# Altium project 2019_FDP_strateasy.PrjPcb
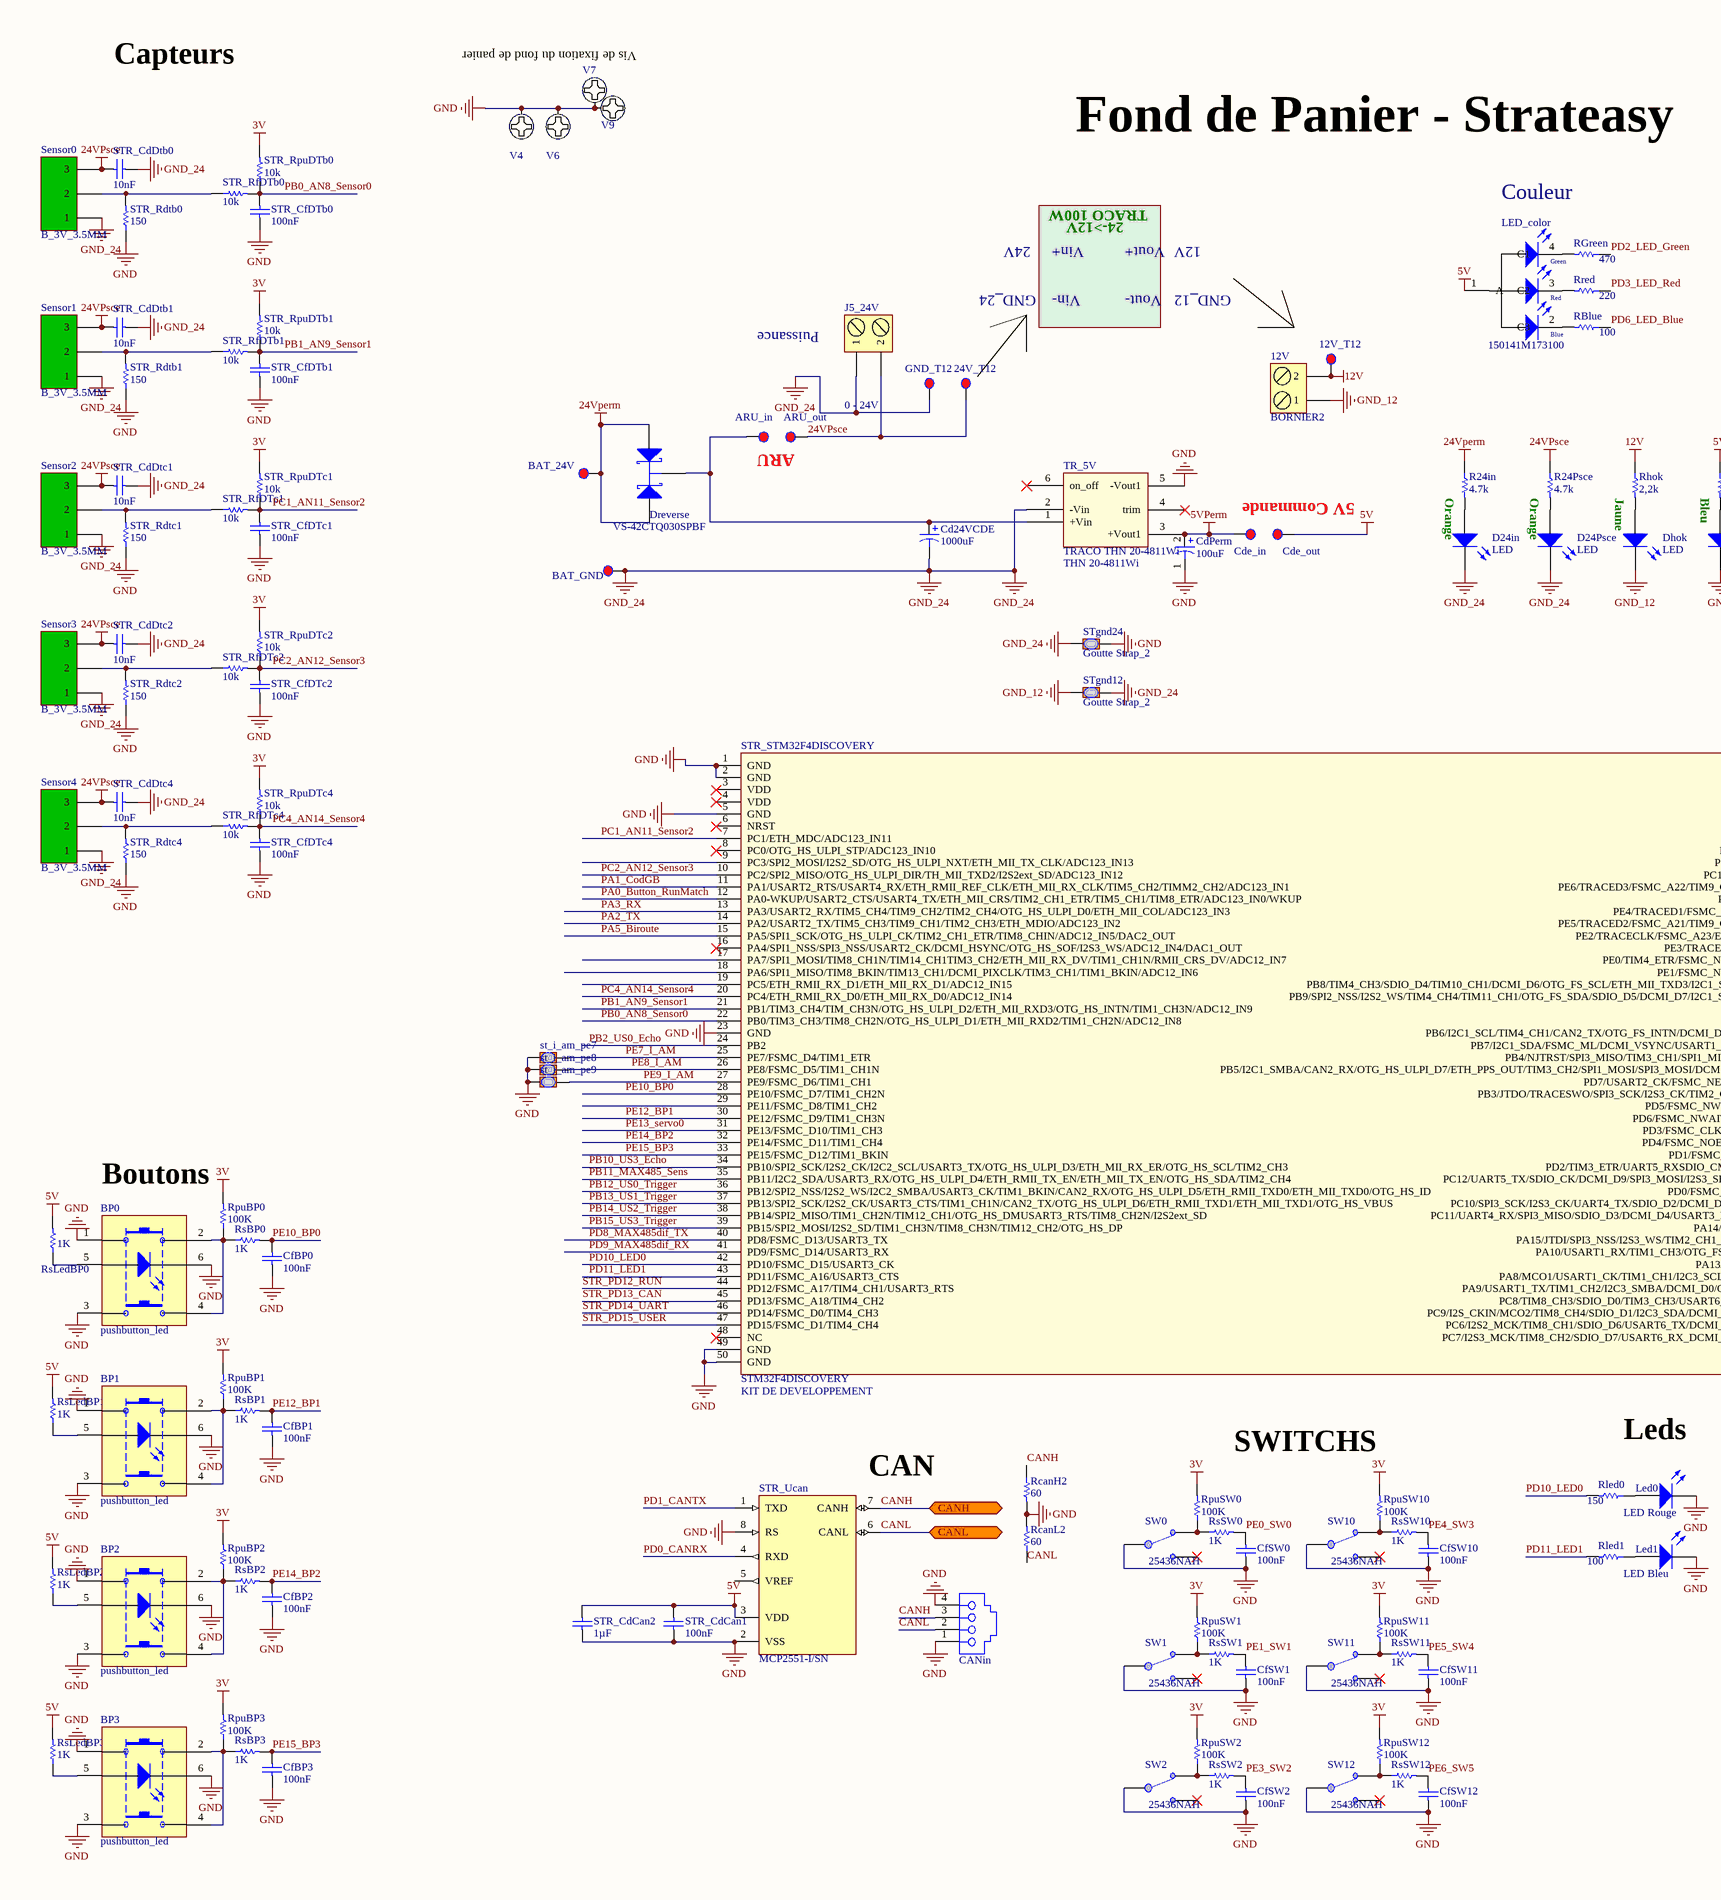
[diagram p0: 2019_FDP_SCHEMA.SchDoc, left]
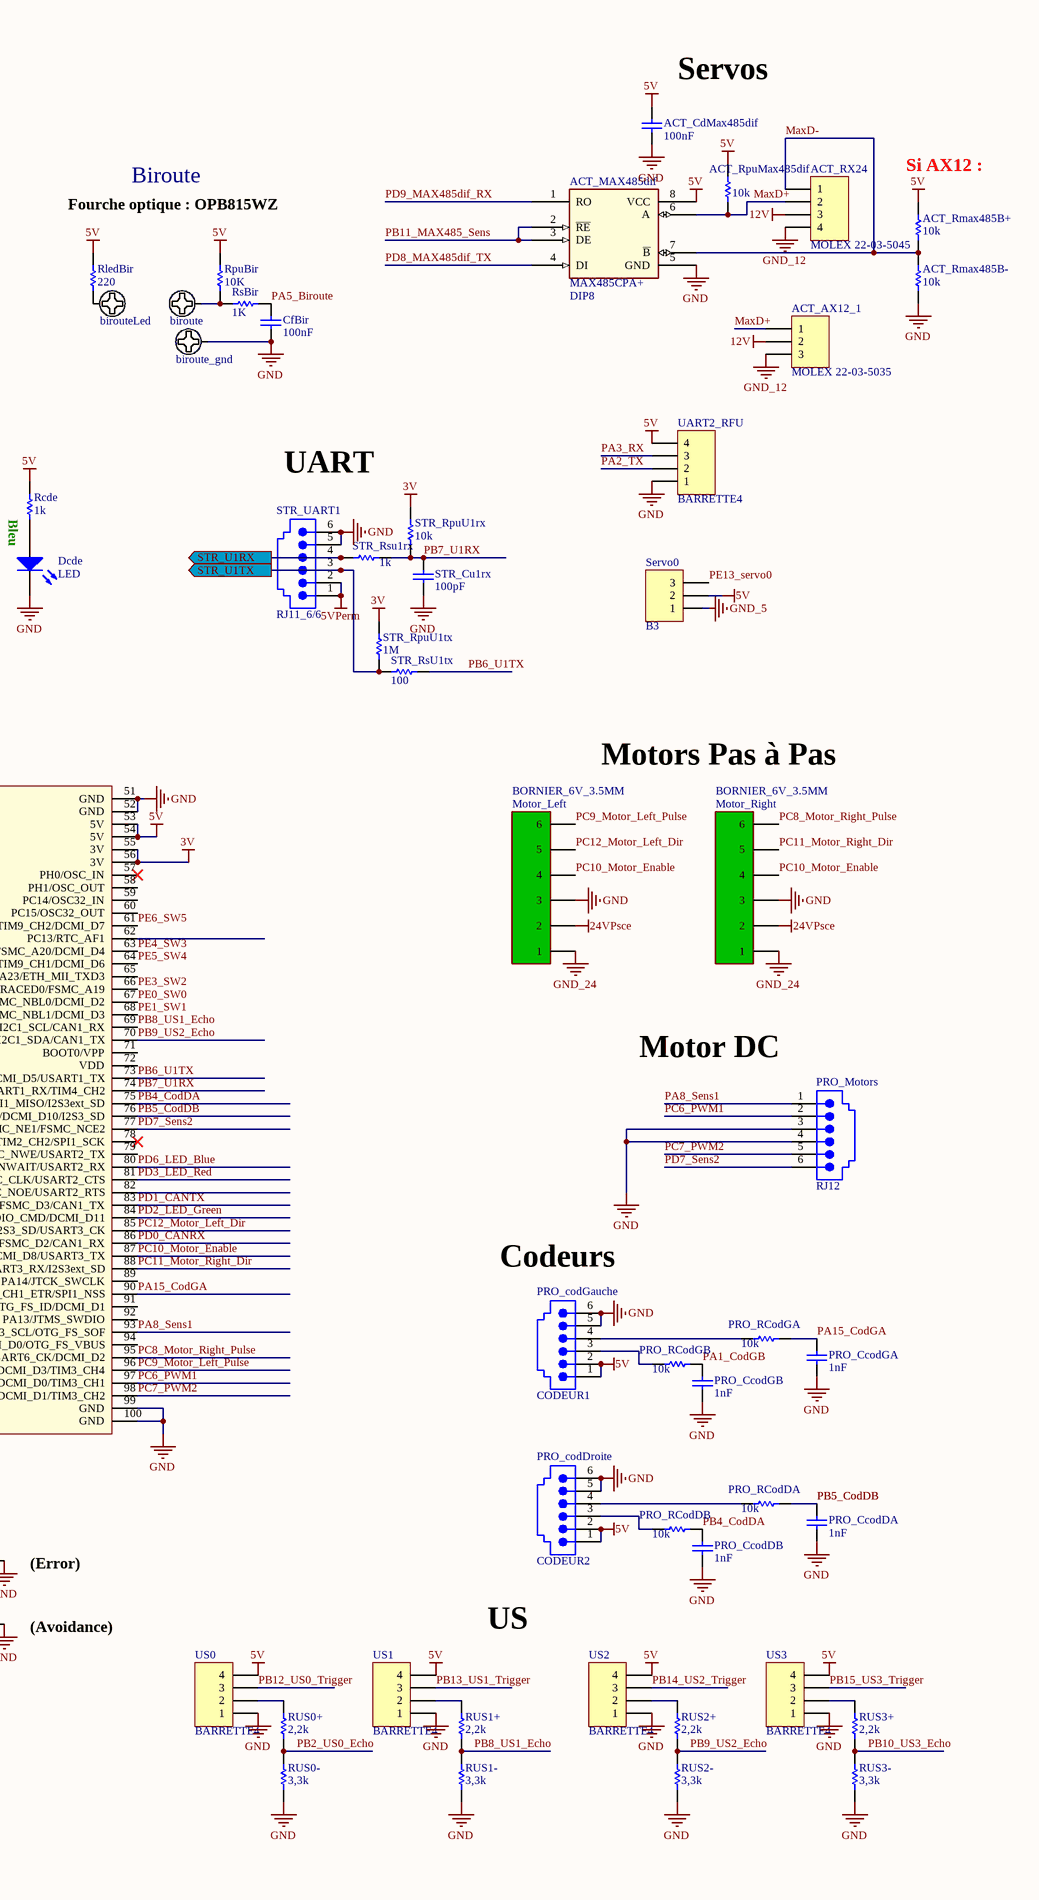
[diagram p1: 2019_FDP_SCHEMA.SchDoc, right]
1 sheet, 168 parts. Net scope: flat (ports and power ports of the same name join across sheets).
Board file: 2019_FDP_strateasy.PcbDoc

## Sheet 2019_FDP_SCHEMA.SchDoc
size A2

### Parts
12V  BORNIER2  [BORNIER_2V_5.08MM]
12V_T12  Name  [Point Test_D3_P1.6mm]  (value not drawn)
24V_T12  Name  [Point Test_D3_P1.6mm]  (value not drawn)
ACT_AX12_1  MOLEX 22-03-5035  [MOLEX3_2.5MM]
ACT_CdMax485dif  100nF  [C0805_N]
ACT_MAX485dif  Type: MAX485CPA+  Package: DIP8  [SO8_N]  (hidden comment: MAX485CPA+_DIP8)
ACT_Rmax485B+  10k  [R1206_N]
ACT_Rmax485B-  10k  [R1206_N]
ACT_RpuMax485dif  10k  [R1206_N]
ACT_RX24  MOLEX 22-03-5045  [MOLEX4_2.5MM]
ARU_in  Name  [Point Test_D3_P1.6mm]  (value not drawn)
ARU_out  Name  [Point Test_D3_P1.6mm]  (value not drawn)
BAT_24V  Name  [Point Test_D3_P1.6mm]  (value not drawn)
BAT_GND  Name  [Point Test_D3_P1.6mm]  (value not drawn)
biroute  Pad_M3  [PAD_CMS_5.08x2.54]  (value not drawn)
biroute_gnd  Pad_M3  [PAD_CMS_5.08x2.54]  (value not drawn)
birouteLed  Pad_M3  [PAD_CMS_5.08x2.54]  (value not drawn)
BP0  pushbutton_led  [PUSHBUTTON_LED]
BP1  pushbutton_led  [PUSHBUTTON_LED]
BP2  pushbutton_led  [PUSHBUTTON_LED]
BP3  pushbutton_led  [PUSHBUTTON_LED]
CANin  634104149621  [634104149621]  (value not drawn)
Cd24VCDE  1000uF  [RESISTANCE_5W]
Cde_in  Name  [Point Test_D3_P1.6mm]  (value not drawn)
Cde_out  Name  [Point Test_D3_P1.6mm]  (value not drawn)
CdPerm  100uF  [CONDENSATEUR_POLARISE_ELECTROLYTIQUE_RADIAL_5.08/8.9]
CfBir  100nF  [C0805_N]
CfBP0  100nF  [C0805_N]
CfBP1  100nF  [C0805_N]
CfBP2  100nF  [C0805_N]
CfBP3  100nF  [C0805_N]
CfSW0  100nF  [C0805_N]
CfSW1  100nF  [C0805_N]
CfSW2  100nF  [C0805_N]
CfSW10  100nF  [C0805_N]
CfSW11  100nF  [C0805_N]
CfSW12  100nF  [C0805_N]
D24in  LED  [LED_0805]
D24Psce  LED  [LED_0805]
Dcde  LED  [LED_0805]
Dhok  LED  [LED_0805]
Dreverse  VS-42CTQ030SPBF  [D2Pak (123)]
GND_T12  Name  [Point Test_D3_P1.6mm]  (value not drawn)
J5_24V  0 - 24V  [BORNIER2_FEM_COUDE]
Led0  LED Rouge  [LED_0805]
Led1  LED Bleu  [LED_0805]
LED_color  150141M173100  [3528]
Motor_Left  BORNIER_6V_3.5MM  [BORNIER_6V_3.5MM]
Motor_Right  BORNIER_6V_3.5MM  [BORNIER_6V_3.5MM]
PRO_CcodDA  1nF  [C0805_N]
PRO_CcodDB  1nF  [C0805_N]
PRO_CcodGA  1nF  [C0805_N]
PRO_CcodGB  1nF  [C0805_N]
PRO_codDroite  CODEUR2  [RJ11_6/6 - droit]
PRO_codGauche  CODEUR1  [RJ11_6/6 - droit]
PRO_Motors  RJ12  [RJ11_6/6 - droit]
PRO_RCodDA  10k  [R1206_N]
PRO_RCodDB  10k  [R1206_N]
PRO_RCodGA  10k  [R1206_N]
PRO_RCodGB  10k  [R1206_N]
R24in  4.7k  [R1206_N]
R24Psce  4.7k  [R1206_N]
RBlue  100  [R1206_N]
RcanH2  60  [R1206_N]
RcanL2  60  [R1206_N]
Rcde  1k  [R1206_N]
RGreen  470  [R1206_N]
Rhok  2,2k  [R1206_N]
Rled0  150  [R1206_N]
Rled1  100  [R1206_N]
RledBir  220  [R1206_N]
RpuBir  10K  [R1206_N]
RpuBP0  100K  [R1206_N]
RpuBP1  100K  [R1206_N]
RpuBP2  100K  [R1206_N]
RpuBP3  100K  [R1206_N]
RpuSW0  100K  [R1206_N]
RpuSW1  100K  [R1206_N]
RpuSW2  100K  [R1206_N]
RpuSW10  100K  [R1206_N]
RpuSW11  100K  [R1206_N]
RpuSW12  100K  [R1206_N]
Rred  220  [R1206_N]
RsBir  1K  [R1206_N]
RsBP0  1K  [R1206_N]
RsBP1  1K  [R1206_N]
RsBP2  1K  [R1206_N]
RsBP3  1K  [R1206_N]
RsLedBP0  1K  [R1206_N]
RsLedBP1  1K  [R1206_N]
RsLedBP2  1K  [R1206_N]
RsLedBP3  1K  [R1206_N]
RsSW0  1K  [R1206_N]
RsSW1  1K  [R1206_N]
RsSW2  1K  [R1206_N]
RsSW10  1K  [R1206_N]
RsSW11  1K  [R1206_N]
RsSW12  1K  [R1206_N]
RUS0+  2,2k  [R1206_N]
RUS0-  3,3k  [R1206_N]
RUS1+  2,2k  [R1206_N]
RUS1-  3,3k  [R1206_N]
RUS2+  2,2k  [R1206_N]
RUS2-  3,3k  [R1206_N]
RUS3+  2,2k  [R1206_N]
RUS3-  3,3k  [R1206_N]
Sensor0  B_3V_3.5MM  [BORNIER_3V_3.5MM]
Sensor1  B_3V_3.5MM  [BORNIER_3V_3.5MM]
Sensor2  B_3V_3.5MM  [BORNIER_3V_3.5MM]
Sensor3  B_3V_3.5MM  [BORNIER_3V_3.5MM]
Sensor4  B_3V_3.5MM  [BORNIER_3V_3.5MM]
Servo0  B3  [HE14_3]
st_i_am_pe7  Goutte Strap_2  [Goutte Strap_2 Pads_Clearance 0.254mm]  (value not drawn)
st_i_am_pe8  Goutte Strap_2  [Goutte Strap_2 Pads_Clearance 0.254mm]  (value not drawn)
st_i_am_pe9  Goutte Strap_2  [Goutte Strap_2 Pads_Clearance 0.254mm]  (value not drawn)
STgnd12  Goutte Strap_2  [Goutte Strap_2 Pads_Clearance 0.254mm]
STgnd24  Goutte Strap_2  [Goutte Strap_2 Pads_Clearance 0.254mm]
STR_CdCan1  100nF  [C0805_N]
STR_CdCan2  1µF  [C0805_N]
STR_CdDtb0  10nF  [C0805_N]
STR_CdDtb1  10nF  [C0805_N]
STR_CdDtc1  10nF  [C0805_N]
STR_CdDtc2  10nF  [C0805_N]
STR_CdDtc4  10nF  [C0805_N]
STR_CfDTb0  100nF  [C0805_N]
STR_CfDTb1  100nF  [C0805_N]
STR_CfDTc1  100nF  [C0805_N]
STR_CfDTc2  100nF  [C0805_N]
STR_CfDTc4  100nF  [C0805_N]
STR_Cu1rx  100pF  [C0805_N]
STR_Rdtb0  150  [R1206_N]
STR_Rdtb1  150  [R1206_N]
STR_Rdtc1  150  [R1206_N]
STR_Rdtc2  150  [R1206_N]
STR_Rdtc4  150  [R1206_N]
STR_RfDTb0  10k  [R1206_N]
STR_RfDTb1  10k  [R1206_N]
STR_RfDTc1  10k  [R1206_N]
STR_RfDTc2  10k  [R1206_N]
STR_RfDTc4  10k  [R1206_N]
STR_RpuDTb0  10k  [R1206_N]
STR_RpuDTb1  10k  [R1206_N]
STR_RpuDTc1  10k  [R1206_N]
STR_RpuDTc2  10k  [R1206_N]
STR_RpuDTc4  10k  [R1206_N]
STR_RpuU1rx  10k  [R1206_N]
STR_RpuU1tx  1M  [R1206_N]
STR_Rsu1rx  1k  [R1206_N]
STR_RsU1tx  100  [R1206_N]
STR_STM32F4DISCOVERY  STM32F4DISCOVERY  Type: KIT DE DEVELOPPEMENT  [STM32_F4DISCOVERY]
STR_UART1  RJ11_6/6  [RJ11_6/6 - droit]
STR_Ucan  MCP2551-I/SN  [SO8_N]
SW0  25436NAH  [SW_UNIPOL_DROIT - Ebay - SPDT - 11x6x5]
SW1  25436NAH  [SW_UNIPOL_DROIT - Ebay - SPDT - 11x6x5]
SW2  25436NAH  [SW_UNIPOL_DROIT - Ebay - SPDT - 11x6x5]
SW10  25436NAH  [SW_UNIPOL_DROIT - Ebay - SPDT - 11x6x5]
SW11  25436NAH  [SW_UNIPOL_DROIT - Ebay - SPDT - 11x6x5]
SW12  25436NAH  [SW_UNIPOL_DROIT - Ebay - SPDT - 11x6x5]
TR_5V  TRACO THN 20-4811Wi  Ref: THN 20-4811Wi  [TRACO_THN20]
UART2_RFU  BARRETTE4  [HE14_4]
US0  BARRETTE4  [HE14_4]
US1  BARRETTE4  [HE14_4]
US2  BARRETTE4  [HE14_4]
US3  BARRETTE4  [HE14_4]
V4  Pad_M3  [M3x6mm Torx]  (value not drawn)
V6  Pad_M3  [M3x6mm Torx]  (value not drawn)
V7  Pad_M3  [M3x6mm Torx]  (value not drawn)
V9  Pad_M3  [M3x6mm Torx]  (value not drawn)

### Ports
CANH (bidir), CANL (bidir), STR_U1RX (out), STR_U1TX (out)

### Nets
3V: RpuBP0.2 RpuBP1.2 RpuBP2.2 RpuBP3.2 RpuSW0.2 RpuSW1.2 RpuSW2.2 RpuSW10.2 RpuSW11.2 RpuSW12.2 STR_RpuDTb0.2 STR_RpuDTb1.2 STR_RpuDTc1.2 STR_RpuDTc2.2 STR_RpuDTc4.2 STR_RpuU1rx.2 STR_RpuU1tx.2 STR_STM32F4DISCOVERY.55(3V) STR_STM32F4DISCOVERY.56(3V)
5V: ACT_CdMax485dif.2 ACT_MAX485dif.8(VCC) ACT_Rmax485B+.2 ACT_RpuMax485dif.2 Cde_out.1 LED_color.1(A) PRO_codDroite.1 PRO_codDroite.2 PRO_codGauche.1 PRO_codGauche.2 Rcde.1 RledBir.2 RpuBir.2 RsLedBP0.2 RsLedBP1.2 RsLedBP2.2 RsLedBP3.2 Servo0.2 STR_CdCan1.2 STR_CdCan2.2 STR_STM32F4DISCOVERY.53(5V) STR_STM32F4DISCOVERY.54(5V) STR_Ucan.3(VDD) UART2_RFU.4 US0.4 US1.4 US2.4 US3.4
5VPerm: Cde_in.1 CdPerm.2 STR_UART1.1 STR_UART1.2 TR_5V.3(+Vout1)
12V: 12V.2 12V_T12.1 ACT_AX12_1.2 ACT_RX24.3 Rhok.1
24Vperm: BAT_24V.1 Dreverse.1(A1) Dreverse.3(A2) R24in.1
24VPsce: 24V_T12.1 ARU_out.1 J5_24V.2 Motor_Left.2 Motor_Right.2 R24Psce.1 Sensor0.3 Sensor1.3 Sensor2.3 Sensor3.3 Sensor4.3 STR_CdDtb0.2 STR_CdDtb1.2 STR_CdDtc1.2 STR_CdDtc2.2 STR_CdDtc4.2
GND: ACT_CdMax485dif.1 ACT_MAX485dif.5(GND) ACT_Rmax485B-.1 biroute_gnd.1 BP0.1 BP0.3 BP0.6(-) BP1.1 BP1.3 BP1.6(-) BP2.1 BP2.3 BP2.6(-) BP3.1 BP3.3 BP3.6(-) CANin.1 CANin.4 CdPerm.1 CfBir.1 CfBP0.1 CfBP1.1 CfBP2.1 CfBP3.1 CfSW0.1 CfSW1.1 CfSW2.1 CfSW10.1 CfSW11.1 CfSW12.1 Dcde.2(K) Led0.2(K) Led1.2(K) Motor_Left.3 Motor_Right.3 PRO_CcodDA.1 PRO_CcodDB.1 PRO_CcodGA.1 PRO_CcodGB.1 PRO_codDroite.5 PRO_codDroite.6 PRO_codGauche.5 PRO_codGauche.6 PRO_Motors.3 PRO_Motors.4 RcanH2.2 RcanL2.2 RUS0-.1 RUS1-.1 RUS2-.1 RUS3-.1 st_i_am_pe7.1 st_i_am_pe8.1 st_i_am_pe9.1 STgnd24.2 STR_CdCan1.1 STR_CdCan2.1 STR_CfDTb0.1 STR_CfDTb1.1 STR_CfDTc1.1 STR_CfDTc2.1 STR_CfDTc4.1 STR_Cu1rx.1 STR_Rdtb0.1 STR_Rdtb1.1 STR_Rdtc1.1 STR_Rdtc2.1 STR_Rdtc4.1 STR_STM32F4DISCOVERY.1(GND) STR_STM32F4DISCOVERY.2(GND) STR_STM32F4DISCOVERY.5(GND) STR_STM32F4DISCOVERY.23(GND) STR_STM32F4DISCOVERY.49(GND) STR_STM32F4DISCOVERY.50(GND) STR_STM32F4DISCOVERY.51(GND) STR_STM32F4DISCOVERY.52(GND) STR_STM32F4DISCOVERY.99(GND) STR_STM32F4DISCOVERY.100(GND) STR_UART1.5 STR_UART1.6 STR_Ucan.2(VSS) STR_Ucan.8(RS) SW0.COMMON1 SW1.COMMON1 SW2.COMMON1 SW10.COMMON1 SW11.COMMON1 SW12.COMMON1 TR_5V.5(-Vout1) UART2_RFU.1 US0.1 US1.1 US2.1 US3.1 V4.1 V6.1 V7.1 V9.1
GND_5: Servo0.1
GND_12: 12V.1 ACT_AX12_1.3 ACT_RX24.4 Dhok.2(K) STgnd12.1
GND_24: BAT_GND.1 Cd24VCDE.1 D24in.2(K) D24Psce.2(K) GND_T12.1 J5_24V.1 Motor_Left.1 Motor_Right.1 Sensor0.1 Sensor1.1 Sensor2.1 Sensor3.1 Sensor4.1 STgnd12.2 STgnd24.1 STR_CdDtb0.1 STR_CdDtb1.1 STR_CdDtc1.1 STR_CdDtc2.1 STR_CdDtc4.1 TR_5V.2(-Vin)
CANH: CANin.3 RcanH2.1 STR_Ucan.7(CANH) ; port CANH
CANL: CANin.2 RcanL2.1 STR_Ucan.6(CANL) ; port CANL
MaxD+: ACT_AX12_1.1 ACT_MAX485dif.6(A) ACT_RpuMax485dif.1 ACT_RX24.2
MaxD-: ACT_MAX485dif.7(~{B}) ACT_Rmax485B+.1 ACT_Rmax485B-.2 ACT_RX24.1
PA0_Button_RunMatch: STR_STM32F4DISCOVERY.12(PA0-WKUP/USART2_CTS/USART4_TX/ETH_MII_CRS/TIM2_CH1_ETR/TIM5_CH1/TIM8_ETR/ADC123_IN0/WKUP)
PA1_CodGB: PRO_CcodGB.2 PRO_RCodGB.1 STR_STM32F4DISCOVERY.11(PA1/USART2_RTS/USART4_RX/ETH_RMII_REF_CLK/ETH_MII_RX_CLK/TIM5_CH2/TIMM2_CH2/ADC123_IN1)
PA2_TX: STR_STM32F4DISCOVERY.14(PA2/USART2_TX/TIM5_CH3/TIM9_CH1/TIM2_CH3/ETH_MDIO/ADC123_IN2) UART2_RFU.2
PA3_RX: STR_STM32F4DISCOVERY.13(PA3/USART2_RX/TIM5_CH4/TIM9_CH2/TIM2_CH4/OTG_HS_ULPI_D0/ETH_MII_COL/ADC123_IN3) UART2_RFU.3
PA5_Biroute: CfBir.2 RsBir.2 STR_STM32F4DISCOVERY.15(PA5/SPI1_SCK/OTG_HS_ULPI_CK/TIM2_CH1_ETR/TIM8_CHIN/ADC12_IN5/DAC2_OUT)
PA8_Sens1: PRO_Motors.1 STR_STM32F4DISCOVERY.93(PA8/MCO1/USART1_CK/TIM1_CH1/I2C3_SCL/OTG_FS_SOF)
PA15_CodGA: PRO_CcodGA.2 PRO_RCodGA.1 STR_STM32F4DISCOVERY.90(PA15/JTDI/SPI3_NSS/I2S3_WS/TIM2_CH1_ETR/SPI1_NSS)
PB0_AN8_Sensor0: STR_CfDTb0.2 STR_RfDTb0.2 STR_RpuDTb0.1 STR_STM32F4DISCOVERY.22(PB0/TIM3_CH3/TIM8_CH2N/OTG_HS_ULPI_D1/ETH_MII_RXD2/TIM1_CH2N/ADC12_IN8)
PB1_AN9_Sensor1: STR_CfDTb1.2 STR_RfDTb1.2 STR_RpuDTb1.1 STR_STM32F4DISCOVERY.21(PB1/TIM3_CH4/TIM_CH3N/OTG_HS_ULPI_D2/ETH_MII_RXD3/OTG_HS_INTN/TIM1_CH3N/ADC12_IN9)
PB2_US0_Echo: RUS0+.1 RUS0-.2 STR_STM32F4DISCOVERY.24(PB2)
PB4_CodDA: PRO_CcodDB.2 PRO_RCodDB.1 STR_STM32F4DISCOVERY.75(PB4/NJTRST/SPI3_MISO/TIM3_CH1/SPI1_MISO/I2S3ext_SD)
PB5_CodDB: PRO_CcodDA.2 PRO_RCodDA.1 STR_STM32F4DISCOVERY.76(PB5/I2C1_SMBA/CAN2_RX/OTG_HS_ULPI_D7/ETH_PPS_OUT/TIM3_CH2/SPI1_MOSI/SPI3_MOSI/DCMI_D10/I2S3_SD)
PB6_U1TX: STR_RsU1tx.2 STR_STM32F4DISCOVERY.73(PB6/I2C1_SCL/TIM4_CH1/CAN2_TX/OTG_FS_INTN/DCMI_D5/USART1_TX)
PB7_U1RX: STR_Cu1rx.2 STR_RpuU1rx.1 STR_Rsu1rx.1 STR_STM32F4DISCOVERY.74(PB7/I2C1_SDA/FSMC_ML/DCMI_VSYNC/USART1_RX/TIM4_CH2)
PB8_US1_Echo: RUS1+.1 RUS1-.2 STR_STM32F4DISCOVERY.69(PB8/TIM4_CH3/SDIO_D4/TIM10_CH1/DCMI_D6/OTG_FS_SCL/ETH_MII_TXD3/I2C1_SCL/CAN1_RX)
PB9_US2_Echo: RUS2+.1 RUS2-.2 STR_STM32F4DISCOVERY.70(PB9/SPI2_NSS/I2S2_WS/TIM4_CH4/TIM11_CH1/OTG_FS_SDA/SDIO_D5/DCMI_D7/I2C1_SDA/CAN1_TX)
PB10_US3_Echo: RUS3+.1 RUS3-.2 STR_STM32F4DISCOVERY.34(PB10/SPI2_SCK/I2S2_CK/I2C2_SCL/USART3_TX/OTG_HS_ULPI_D3/ETH_MII_RX_ER/OTG_HS_SCL/TIM2_CH3)
PB11_MAX485_Sens: ACT_MAX485dif.2(~{RE}) ACT_MAX485dif.3(DE) STR_STM32F4DISCOVERY.35(PB11/I2C2_SDA/USART3_RX/OTG_HS_ULPI_D4/ETH_RMII_TX_EN/ETH_MII_TX_EN/OTG_HS_SDA/TIM2_CH4)
PB12_US0_Trigger: STR_STM32F4DISCOVERY.36(PB12/SPI2_NSS/I2S2_WS/I2C2_SMBA/USART3_CK/TIM1_BKIN/CAN2_RX/OTG_HS_ULPI_D5/ETH_RMII_TXD0/ETH_MII_TXD0/OTG_HS_ID) US0.3
PB13_US1_Trigger: STR_STM32F4DISCOVERY.37(PB13/SPI2_SCK/I2S2_CK/USART3_CTS/TIM1_CH1N/CAN2_TX/OTG_HS_ULPI_D6/ETH_RMII_TXD1/ETH_MII_TXD1/OTG_HS_VBUS) US1.3
PB14_US2_Trigger: STR_STM32F4DISCOVERY.38(PB14/SPI2_MISO/TIM1_CH2N/TIM12_CH1/OTG_HS_DMUSART3_RTS/TIM8_CH2N/I2S2ext_SD) US2.3
PB15_US3_Trigger: STR_STM32F4DISCOVERY.39(PB15/SPI2_MOSI/I2S2_SD/TIM1_CH3N/TIM8_CH3N/TIM12_CH2/OTG_HS_DP) US3.3
PC1_AN11_Sensor2: STR_CfDTc1.2 STR_RfDTc1.2 STR_RpuDTc1.1 STR_STM32F4DISCOVERY.7(PC1/ETH_MDC/ADC123_IN11)
PC2_AN12_Sensor3: STR_CfDTc2.2 STR_RfDTc2.2 STR_RpuDTc2.1 STR_STM32F4DISCOVERY.10(PC2/SPI2_MISO/OTG_HS_ULPI_DIR/TH_MII_TXD2/I2S2ext_SD/ADC123_IN12)
PC4_AN14_Sensor4: STR_CfDTc4.2 STR_RfDTc4.2 STR_RpuDTc4.1 STR_STM32F4DISCOVERY.20(PC4/ETH_RMII_RX_D0/ETH_MII_RX_D0/ADC12_IN14)
PC6_PWM1: PRO_Motors.2 STR_STM32F4DISCOVERY.97(PC6/I2S2_MCK/TIM8_CH1/SDIO_D6/USART6_TX/DCMI_D0/TIM3_CH1)
PC7_PWM2: PRO_Motors.5 STR_STM32F4DISCOVERY.98(PC7/I2S3_MCK/TIM8_CH2/SDIO_D7/USART6_RX_DCMI_D1/TIM3_CH2)
PC8_Motor_Right_Pulse: Motor_Right.6 STR_STM32F4DISCOVERY.95(PC8/TIM8_CH3/SDIO_D0/TIM3_CH3/USART6_CK/DCMI_D2)
PC9_Motor_Left_Pulse: Motor_Left.6 STR_STM32F4DISCOVERY.96(PC9/I2S_CKIN/MCO2/TIM8_CH4/SDIO_D1/I2C3_SDA/DCMI_D3/TIM3_CH4)
PC10_Motor_Enable: Motor_Left.4 Motor_Right.4 STR_STM32F4DISCOVERY.87(PC10/SPI3_SCK/I2S3_CK/UART4_TX/SDIO_D2/DCMI_D8/USART3_TX)
PC11_Motor_Right_Dir: Motor_Right.5 STR_STM32F4DISCOVERY.88(PC11/UART4_RX/SPI3_MISO/SDIO_D3/DCMI_D4/USART3_RX/I2S3ext_SD)
PC12_Motor_Left_Dir: Motor_Left.5 STR_STM32F4DISCOVERY.85(PC12/UART5_TX/SDIO_CK/DCMI_D9/SPI3_MOSI/I2S3_SD/USART3_CK)
PD0_CANRX: STR_STM32F4DISCOVERY.86(PD0/FSMC_D2/CAN1_RX) STR_Ucan.4(RXD)
PD1_CANTX: STR_STM32F4DISCOVERY.83(PD1/FSMC_D3/CAN1_TX) STR_Ucan.1(TXD)
PD2_LED_Green: RGreen.1 STR_STM32F4DISCOVERY.84(PD2/TIM3_ETR/UART5_RXSDIO_CMD/DCMI_D11)
PD3_LED_Red: Rred.1 STR_STM32F4DISCOVERY.81(PD3/FSMC_CLK/USART2_CTS)
PD6_LED_Blue: RBlue.1 STR_STM32F4DISCOVERY.80(PD6/FSMC_NWAIT/USART2_RX)
PD7_Sens2: PRO_Motors.6 STR_STM32F4DISCOVERY.77(PD7/USART2_CK/FSMC_NE1/FSMC_NCE2)
PD8_MAX485dif_TX: ACT_MAX485dif.4(DI) STR_STM32F4DISCOVERY.40(PD8/FSMC_D13/USART3_TX)
PD9_MAX485dif_RX: ACT_MAX485dif.1(RO) STR_STM32F4DISCOVERY.41(PD9/FSMC_D14/USART3_RX)
PD10_LED0: Rled0.2 STR_STM32F4DISCOVERY.42(PD10/FSMC_D15/USART3_CK)
PD11_LED1: Rled1.2 STR_STM32F4DISCOVERY.43(PD11/FSMC_A16/USART3_CTS)
PE0_SW0: CfSW0.2 RsSW0.2 STR_STM32F4DISCOVERY.67(PE0/TIM4_ETR/FSMC_NBL0/DCMI_D2)
PE1_SW1: CfSW1.2 RsSW1.2 STR_STM32F4DISCOVERY.68(PE1/FSMC_NBL1/DCMI_D3)
PE3_SW2: CfSW2.2 RsSW2.2 STR_STM32F4DISCOVERY.66(PE3/TRACED0/FSMC_A19)
PE4_SW3: CfSW10.2 RsSW10.2 STR_STM32F4DISCOVERY.63(PE4/TRACED1/FSMC_A20/DCMI_D4)
PE5_SW4: CfSW11.2 RsSW11.2 STR_STM32F4DISCOVERY.64(PE5/TRACED2/FSMC_A21/TIM9_CH1/DCMI_D6)
PE6_SW5: CfSW12.2 RsSW12.2 STR_STM32F4DISCOVERY.61(PE6/TRACED3/FSMC_A22/TIM9_CH2/DCMI_D7)
PE7_I_AM: st_i_am_pe7.2 STR_STM32F4DISCOVERY.25(PE7/FSMC_D4/TIM1_ETR)
PE8_I_AM: st_i_am_pe8.2 STR_STM32F4DISCOVERY.26(PE8/FSMC_D5/TIM1_CH1N)
PE9_I_AM: st_i_am_pe9.2 STR_STM32F4DISCOVERY.27(PE9/FSMC_D6/TIM1_CH1)
PE10_BP0: CfBP0.2 RsBP0.2 STR_STM32F4DISCOVERY.28(PE10/FSMC_D7/TIM1_CH2N)
PE12_BP1: CfBP1.2 RsBP1.2 STR_STM32F4DISCOVERY.30(PE12/FSMC_D9/TIM1_CH3N)
PE13_servo0: Servo0.3 STR_STM32F4DISCOVERY.31(PE13/FSMC_D10/TIM1_CH3)
PE14_BP2: CfBP2.2 RsBP2.2 STR_STM32F4DISCOVERY.32(PE14/FSMC_D11/TIM1_CH4)
PE15_BP3: CfBP3.2 RsBP3.2 STR_STM32F4DISCOVERY.33(PE15/FSMC_D12/TIM1_BKIN)
STR_PD12_RUN: STR_STM32F4DISCOVERY.44(PD12/FSMC_A17/TIM4_CH1/USART3_RTS)
STR_PD13_CAN: STR_STM32F4DISCOVERY.45(PD13/FSMC_A18/TIM4_CH2)
STR_PD14_UART: STR_STM32F4DISCOVERY.46(PD14/FSMC_D0/TIM4_CH3)
STR_PD15_USER: STR_STM32F4DISCOVERY.47(PD15/FSMC_D1/TIM4_CH4)
NetARU_in_1: ARU_in.1 Cd24VCDE.2 Dreverse.2(K) TR_5V.1(+Vin)
Netbiroute_1: biroute.1 RpuBir.1 RsBir.1
NetbirouteLed_1: birouteLed.1 RledBir.1
NetBP0_2: BP0.2 BP0.4 RpuBP0.1 RsBP0.1
NetBP0_5: BP0.5(+) RsLedBP0.1
NetBP1_2: BP1.2 BP1.4 RpuBP1.1 RsBP1.1
NetBP1_5: BP1.5(+) RsLedBP1.1
NetBP2_2: BP2.2 BP2.4 RpuBP2.1 RsBP2.1
NetBP2_5: BP2.5(+) RsLedBP2.1
NetBP3_2: BP3.2 BP3.4 RpuBP3.1 RsBP3.1
NetBP3_5: BP3.5(+) RsLedBP3.1
NetD24in_1: D24in.1(A) R24in.2
NetD24Psce_1: D24Psce.1(A) R24Psce.2
NetDcde_1: Dcde.1(A) Rcde.2
NetDhok_1: Dhok.1(A) Rhok.2
NetLed0_1: Led0.1(A) Rled0.1
NetLed1_1: Led1.1(A) Rled1.1
NetLED_color_2: LED_color.2(C3) RBlue.2
NetLED_color_3: LED_color.3(C2) Rred.2
NetLED_color_4: LED_color.4(C1) RGreen.2
NetPRO_codDroite_3: PRO_codDroite.3 PRO_RCodDB.2
NetPRO_codDroite_4: PRO_codDroite.4 PRO_RCodDA.2
NetPRO_codGauche_3: PRO_codGauche.3 PRO_RCodGB.2
NetPRO_codGauche_4: PRO_codGauche.4 PRO_RCodGA.2
NetRpuSW0_1: RpuSW0.1 RsSW0.1 SW0.NC1
NetRpuSW1_1: RpuSW1.1 RsSW1.1 SW1.NC1
NetRpuSW2_1: RpuSW2.1 RsSW2.1 SW2.NC1
NetRpuSW10_1: RpuSW10.1 RsSW10.1 SW10.NC1
NetRpuSW11_1: RpuSW11.1 RsSW11.1 SW11.NC1
NetRpuSW12_1: RpuSW12.1 RsSW12.1 SW12.NC1
NetRUS0+_2: RUS0+.2 US0.2
NetRUS1+_2: RUS1+.2 US1.2
NetRUS2+_2: RUS2+.2 US2.2
NetRUS3+_2: RUS3+.2 US3.2
NetSensor0_2: Sensor0.2 STR_Rdtb0.2 STR_RfDTb0.1
NetSensor1_2: Sensor1.2 STR_Rdtb1.2 STR_RfDTb1.1
NetSensor2_2: Sensor2.2 STR_Rdtc1.2 STR_RfDTc1.1
NetSensor3_2: Sensor3.2 STR_Rdtc2.2 STR_RfDTc2.1
NetSensor4_2: Sensor4.2 STR_Rdtc4.2 STR_RfDTc4.1
NetSTR_RpuU1tx_1: STR_RpuU1tx.1 STR_RsU1tx.1 STR_UART1.3 ; port STR_U1TX
NetSTR_Rsu1rx_2: STR_Rsu1rx.2 STR_UART1.4 ; port STR_U1RX

Not connected (* = marked no-connect by the designer): STR_STM32F4DISCOVERY 3(VDD)* 4(VDD)* 6(NRST)* 8(PC0/OTG_HS_ULPI_STP/ADC123_IN10)* 9(PC3/SPI2_MOSI/I2S2_SD/OTG_HS_ULPI_NXT/ETH_MII_TX_CLK/ADC123_IN13) 16(PA4/SPI1_NSS/SPI3_NSS/USART2_CK/DCMI_HSYNC/OTG_HS_SOF/I2S3_WS/ADC12_IN4/DAC1_OUT)* 17(PA7/SPI1_MOSI/TIM8_CH1N/TIM14_CH1TIM3_CH2/ETH_MII_RX_DV/TIM1_CH1N/RMII_CRS_DV/ADC12_IN7) 18(PA6/SPI1_MISO/TIM8_BKIN/TIM13_CH1/DCMI_PIXCLK/TIM3_CH1/TIM1_BKIN/ADC12_IN6) 19(PC5/ETH_RMII_RX_D1/ETH_MII_RX_D1/ADC12_IN15) 29(PE11/FSMC_D8/TIM1_CH2) 48(NC)* 57(PH0/OSC_IN)* 58(PH1/OSC_OUT) 59(PC14/OSC32_IN) 60(PC15/OSC32_OUT) 62(PC13/RTC_AF1) 65(PE2/TRACECLK/FSMC_A23/ETH_MII_TXD3) 71(BOOT0/VPP) 72(VDD) 78(PB3/JTDO/TRACESWO/SPI3_SCK/I2S3_CK/TIM2_CH2/SPI1_SCK)* 79(PD5/FSMC_NWE/USART2_TX) 82(PD4/FSMC_NOE/USART2_RTS) 89(PA14/JTCK_SWCLK) 91(PA10/USART1_RX/TIM1_CH3/OTG_FS_ID/DCMI_D1) 92(PA13/JTMS_SWDIO) 94(PA9/USART1_TX/TIM1_CH2/I2C3_SMBA/DCMI_D0/OTG_FS_VBUS); STR_Ucan 5(VREF); SW0 NO1*; SW1 NO1*; SW2 NO1*; SW10 NO1*; SW11 NO1*; SW12 NO1*; TR_5V 4(trim)* 6(on_off)*

### Notes on the sheet
- Capteurs
- Vis de fixation du fond de panier
- (near ACT_CdMax485dif) Servos
- Fond de Panier - Strateasy
- 24->12V
- TRACO 100W
- Couleur
- Fourche optique : OPB815WZ
- Biroute
- (near ACT_Rmax485B+) Si AX12 :
- 24V
- Vin+
- Vout+
- 12V
- (near J5_24V) Puissance
- GND_24
- Vin-
- Vout-
- GND_12
- ARU
- UART
- 5V Commande
- Orange
- Jaune
- Bleu
- Motors Pas à Pas
- Motor DC
- (near RpuBP0) Boutons
- (near PRO_codGauche) Codeurs
- (near STR_Ucan) CAN
- SWITCHS
- Leds
- (Error)
- (Avoidance)
- US
- Title
- Size:
- Date:
- File:
- A2
- Number:
- Time:
- Revision:
- Sheet
- of
- (in symbol WL-SFTW 3528 150141M173100) Green; Red; Blue

### Library data of the parts
12V J5_24V = BORNIER2: Terminal blocks, 2 pins, pitch=5mm
12V_T12 24V_T12 ARU_in ARU_out BAT_24V BAT_GND Cde_in Cde_out GND_T12 = Point Test: Publisher: Damien GUITTON
ACT_AX12_1 Servo0 = BARRETTE3: Header, 3-Pin; LatestRevisionDate: 17-Jul-2002; LatestRevisionNote: Re-released for DXP Platform.; Publisher: Altium Limited
ACT_CdMax485dif CfBir CfBP0-CfBP3 CfSW0-CfSW2 CfSW10-CfSW12 PRO_CcodDA PRO_CcodDB PRO_CcodGA PRO_CcodGB STR_CdCan1 STR_CdCan2 STR_CdDtb0 STR_CdDtb1 STR_CdDtc1 STR_CdDtc2 STR_CdDtc4 STR_CfDTb0 STR_CfDTb1 STR_CfDTc1 STR_CfDTc2 STR_CfDTc4 STR_Cu1rx = Condensateur: Capacitor; Published: 8-Jun-2000; LatestRevisionDate: 17-Jul-2002; LatestRevisionNote: Re-released for DXP Platform.; PackageReference: RAD-0.3; Publisher: Altium Limited
ACT_MAX485dif = MAX485CPA+_DIP8: EMETTEUR/RECEPTEUR FAIBLE PUISSANCE DE LIAISONS RS422/RS485 - DIP8
ACT_Rmax485B+ ACT_Rmax485B- ACT_RpuMax485dif PRO_RCodDA PRO_RCodDB PRO_RCodGA PRO_RCodGB R24in R24Psce RBlue RcanH2 RcanL2 Rcde RGreen Rhok Rled0 Rled1 RledBir RpuBir RpuBP0-RpuBP3 RpuSW0-RpuSW2 RpuSW10-RpuSW12 Rred RsBir RsBP0-RsBP3 RsLedBP0-RsLedBP3 RsSW0-RsSW2 RsSW10-RsSW12 RUS0+ RUS0- RUS1+ RUS1- RUS2+ RUS2- RUS3+ RUS3- STR_Rdtb0 STR_Rdtb1 STR_Rdtc1 STR_Rdtc2 STR_Rdtc4 STR_RfDTb0 STR_RfDTb1 STR_RfDTc1 STR_RfDTc2 STR_RfDTc4 STR_RpuDTb0 STR_RpuDTb1 STR_RpuDTc1 STR_RpuDTc2 STR_RpuDTc4 STR_RpuU1rx STR_RpuU1tx STR_Rsu1rx STR_RsU1tx = Resistor: Published: 8-Jun-2000; LatestRevisionDate: 17-Jul-2002; LatestRevisionNote: Re-released for DXP Platform.; PackageReference: AXIAL-0.5; Publisher: Altium Limited
ACT_RX24 UART2_RFU US0-US3 = BARRETTE4: Header, 4-Pin; LatestRevisionDate: 17-Jul-2002; LatestRevisionNote: Re-released for DXP Platform.; Publisher: Altium Limited
biroute biroute_gnd birouteLed V4 V6 V7 V9 = Vis M3 X 6mm _TORX_Tête 6mm: Publisher: Damien Guitton
CANin = 634104149621: Modular Jack SMT Vertical Plastic 4P4C Top Entry WR-MJ; Rated Current: 1.5 A; Working Voltage: 120 VAC; Withstanding Voltage: 1000 VAC; Port: 1x1; ComponentLink1Description: Manufacturer; ComponentLink1URL: http://www.we-online.de; ComponentLink2Description: Datasheet; ComponentLink2URL: http://katalog.we-online.com/em/datasheet/634104149621.pdf; Part Number: 634104149621; Published Date: September 2017; Publisher: Wurth Elektronik; Pin Number: 4P4C; Entrance: Vertical
Cd24VCDE CdPerm = Condensateur Polarise Traversant: Polarized Capacitor
D24in D24Psce Dcde Dhok Led0 Led1 = LED: Typical LED; Published: 8-Jun-2000; LatestRevisionDate: 08-Jul-2005; LatestRevisionNote: Mech Layer 1 removed.; PackageReference: LED-1; Publisher: Altium Limited
Dreverse = Diode Shottky double BAT54C: DIODE SCHOTTKY DOUBLE; Manufacturer Part Number: BAT54C; Manufacturer: ZETEX; Diode Case Style: SOT-23; Supplier Part Number: 9526501; Supplier: Farnell; ComponentLink1URL: http://www.farnell.com/datasheets/27632.pdf; ComponentLink1Description: http://www.farnell.com/datasheets/27632.pdf; Pricing: 5=0,32, 25=0,23, 100=0,198, 1000=0,154 (EUR); RoHS: YES
LED_color = WL-SFTW 3528 150141M173100: SMD Full-Color Top LED, WL-SFTW, Red & Green & Blue; Manufacturer: Würth Elektronik eiSos GmbH; PartNo: 150141M173100; ComponentLink1Description: Manufacturer; ComponentLink1URL: http://www.we-online.de; Created by: Christin Otto; Created Date: June 2013; ComponentLink2Description: Datasheet; ComponentLink2URL: http://katalog.we-online.com/led/datasheet/150141M173100.pdf; Color: Red & Green & Blue
PRO_codDroite PRO_codGauche PRO_Motors STR_UART1 = RJ11_6/6: Right Angle, Standard Profile, Offset Latch DECconnect, Flangeless PCB Jack; Ports: 1; Positions/Loaded: Port1 - 6 Offset Latch/6; PerformanceCategory: 3; PCB_Mounting: Thru-Hole; DrillSize: Nominal, Rounded to nearest 0.05mm; PCB_Layout: Complies with Manufacturer's Recommendation.; Published: 25-Jun-2002; DatasheetDocument: 18-Dec-2001; PackageDocument: 18-Dec-2001; PackageReference: 15-43-6110; Publisher: Altium Limited; ComponentLink1Description: Manufacturer Link; ComponentLink1URL: http://www.molex.com/; ComponentLink2Description: Datasheet; ComponentLink2URL: http://www.molex.com/cmc_upload/common_files/1212003_41369catalogpage.pdf
  PRO_Motors STR_UART1: Type: RJ11_6/6
Sensor0-Sensor4 = BORNIER_3V_3.5MM
STR_STM32F4DISCOVERY = STM32F4DISCOVERY: KIT DE DEVELOPPEMENT POUR MICROCONTROLEUR STM32F407VGT6
STR_Ucan = MCP2551-I/SN: High-Speed CAN Transceiver, 8-Pin SOIC, Industrial Temperature; Published: 25/11/09; DatasheetVersion: revE, Jan-2007; PackageVersion: revAW, Oct-2008; PackageReference: SOIC-SN8; Publisher: Damien Guitton; PackageDescription: 8-Lead Plastic Small Outline (SN) - Narrow, 3.90mm Body [SOIC]; Code_JEDEC: MS-012; Code_IPC: SOIC127P600-8; ComponentLink1Description: Manufacturer Link; ComponentLink1URL: http://www.microchip.com; ComponentLink2Description: Datasheet; ComponentLink2URL: http://ww1.microchip.com/downloads/en/DeviceDoc/21667E.pdf; ComponentLink3Description: Packaging Specification; ComponentLink3URL: http://ww1.microchip.com/downloads/en/PackagingSpec/00049AW.pdf
SW0-SW2 SW10-SW12 = SW SPDT- APEM Série 523x: Switch unipolaire a levier
TR_5V = TRACO THN 20-4811Wi: Traco 20W 24V to 5V*4A
st_i_am_pe7-st_i_am_pe9 STgnd12 STgnd24 = Goutte Strap_2: LatestRevisionDate: 30/01/11; Publisher: Damien Guitton